# Altium schematic sheet Interface.SchDoc
size B; DocumentNumber: 3; SheetNumber: 3; SheetTotal: 7; ENG_APP_DATE: --/--/--; DSN_APP_DATE: --/--/--; CHK_APP_DATE: --/--/--
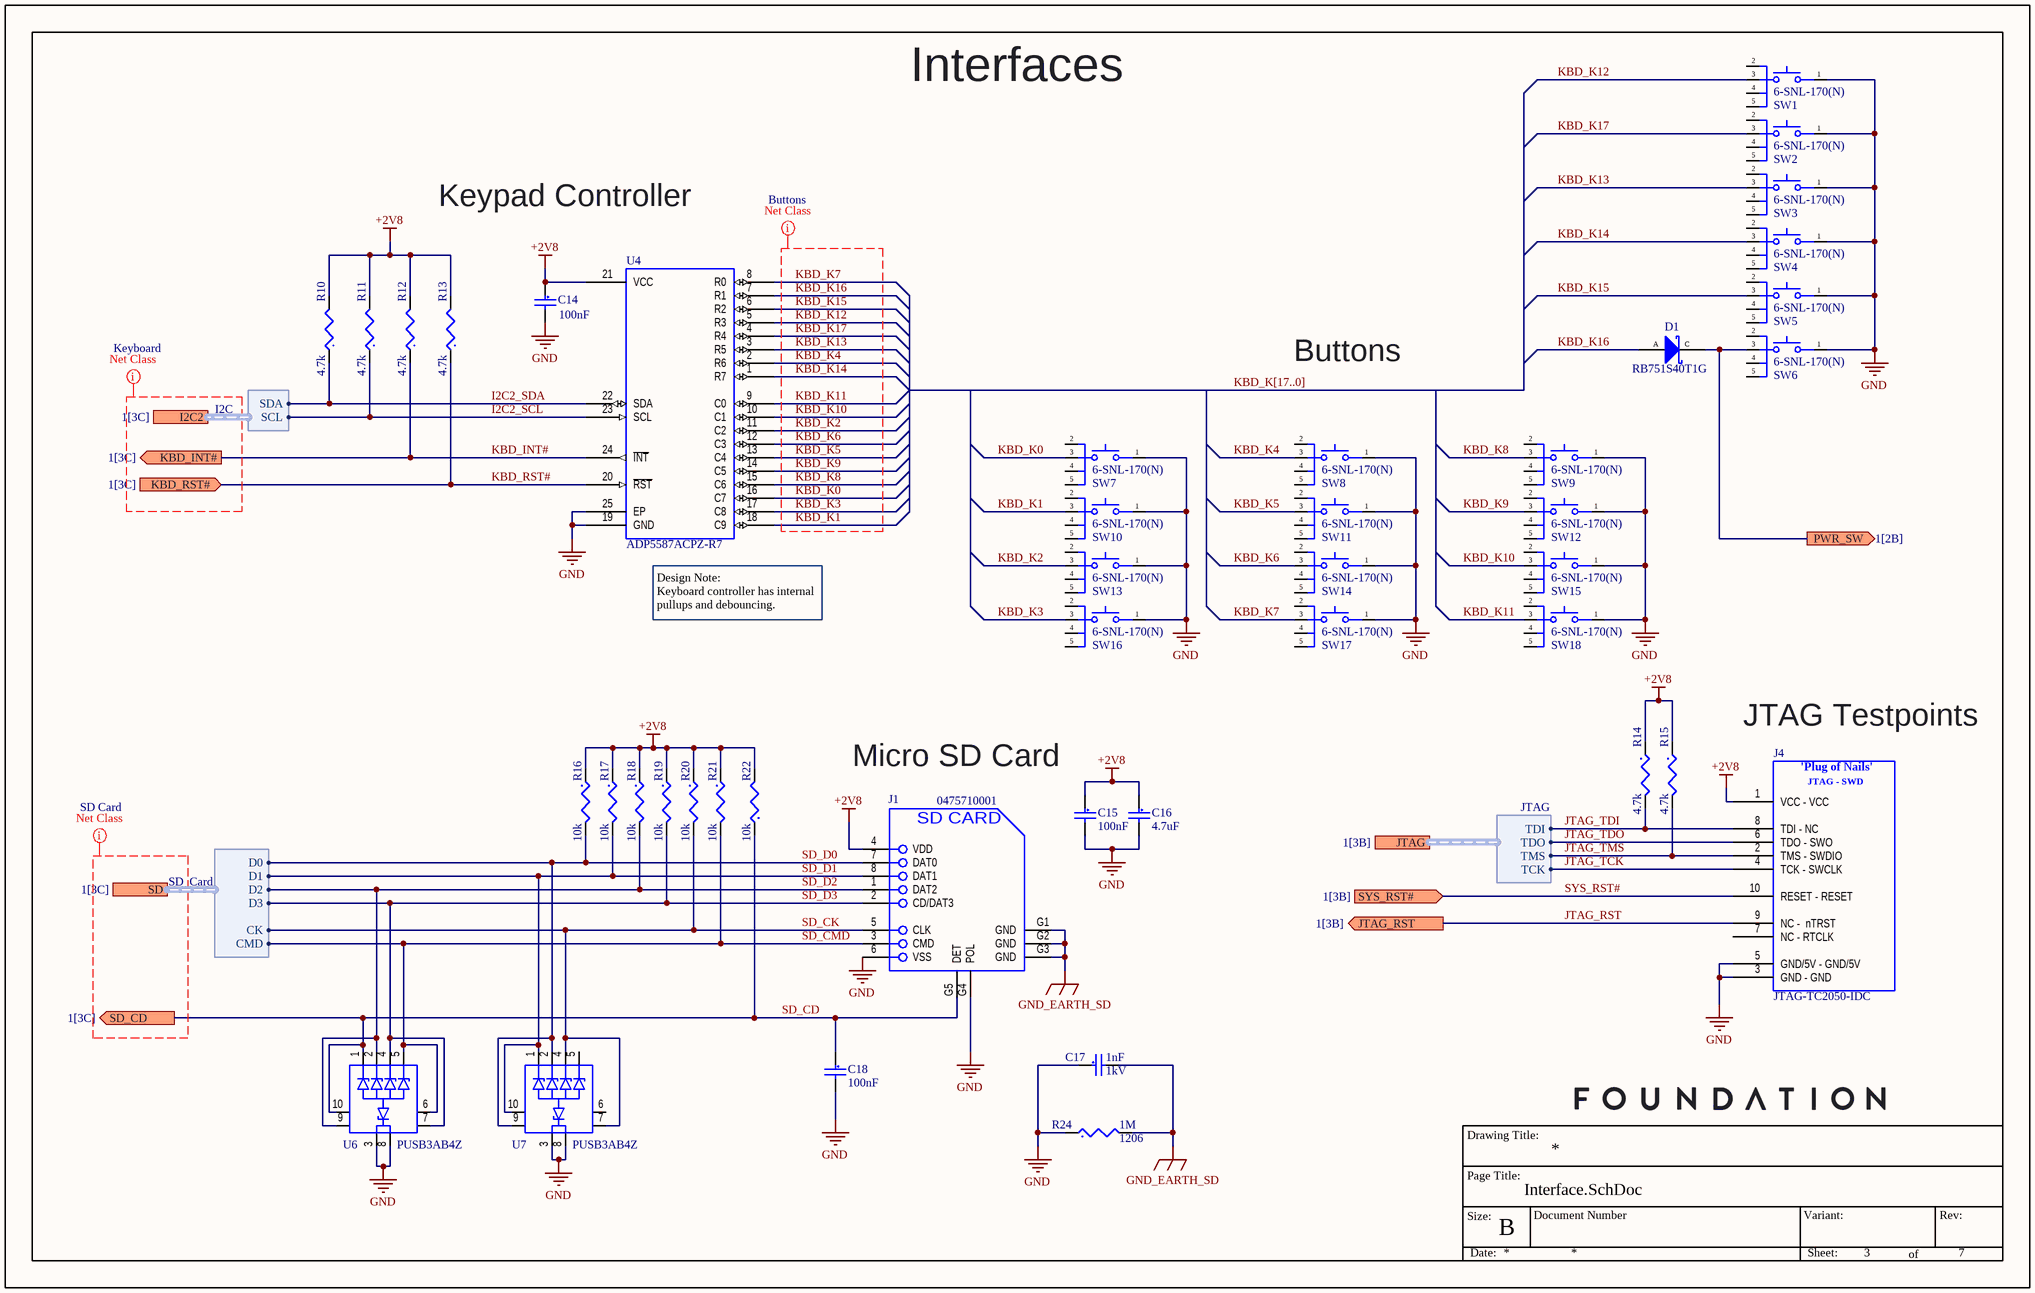
[diagram p0: Interface.SchDoc]

## Parts
C14  Capacitance: 100nF  [CAPC0402(1005)55_L]  (hidden comment: CAP CER 0.1uF 16V 10% X7R 0402)
C15  Capacitance: 100nF  [CAPC0402(1005)55_L]  (hidden comment: CAP CER 0.1uF 16V 10% X7R 0402)
C16  Capacitance: 4.7uF  [CAPC0603(1608)90_L]  (hidden comment: CAP CER 4.7uF 16V 10% X5R 0603)
C17  Capacitance: 1nF  Voltage Rating (DC): 1kV  [CAPC0805(2012)145_N]  (hidden comment: CAP CER 1000pF 1000V 10% X7R 0805)
C18  Capacitance: 100nF  [CAPC0402(1005)55_L]  (hidden comment: CAP CER 0.1uF 16V 10% X7R 0402)
D1  RB751S40T1G  [ON - SOD-523_V]
J1  0475710001  [MOLX - 0475710001_V]
J4  JTAG-TC2050-IDC  [TAGC - TC2050-IDC-FP_V]  (no BOM)
R10  Resistance: 4.7k  [RESC0402(1005)_L]  (hidden comment: RES 4.7K 1/16W 1% 0402)
R11  Resistance: 4.7k  [RESC0402(1005)_L]  (hidden comment: RES 4.7K 1/16W 1% 0402)
R12  Resistance: 4.7k  [RESC0402(1005)_L]  (hidden comment: RES 4.7K 1/16W 1% 0402)
R13  Resistance: 4.7k  [RESC0402(1005)_L]  (hidden comment: RES 4.7K 1/16W 1% 0402)
R14  Resistance: 4.7k  [RESC0402(1005)_L]  (hidden comment: RES 4.7K 1/16W 1% 0402)
R15  Resistance: 4.7k  [RESC0402(1005)_L]  (hidden comment: RES 4.7K 1/16W 1% 0402)
R16  Resistance: 10k  [RESC0402(1005)_L]  (hidden comment: RES 10K 1/16W 1% 0402)
R17  Resistance: 10k  [RESC0402(1005)_L]  (hidden comment: RES 10K 1/16W 1% 0402)
R18  Resistance: 10k  [RESC0402(1005)_L]  (hidden comment: RES 10K 1/16W 1% 0402)
R19  Resistance: 10k  [RESC0402(1005)_L]  (hidden comment: RES 10K 1/16W 1% 0402)
R20  Resistance: 10k  [RESC0402(1005)_L]  (hidden comment: RES 10K 1/16W 1% 0402)
R21  Resistance: 10k  [RESC0402(1005)_L]  (hidden comment: RES 10K 1/16W 1% 0402)
R22  Resistance: 10k  [RESC0402(1005)_L]  (hidden comment: RES 10K 1/16W 1% 0402)
R24  Resistance: 1M  Case Code (Imperial): 1206  [RESC1206(3216)_L]  (hidden comment: RES 1.0M 1/4W 5% 1206)
SW1  6-SNL-170(N)  [TACT - 6-SNL-170_NTP_V]
SW2  6-SNL-170(N)  [TACT - 6-SNL-170_NTP_V]
SW3  6-SNL-170(N)  [TACT - 6-SNL-170_NTP_V]
SW4  6-SNL-170(N)  [TACT - 6-SNL-170_NTP_V]
SW5  6-SNL-170(N)  [TACT - 6-SNL-170_NTP_V]
SW6  6-SNL-170(N)  [TACT - 6-SNL-170_NTP_V]
SW7  6-SNL-170(N)  [TACT - 6-SNL-170_NTP_V]
SW8  6-SNL-170(N)  [TACT - 6-SNL-170_NTP_V]
SW9  6-SNL-170(N)  [TACT - 6-SNL-170_NTP_V]
SW10  6-SNL-170(N)  [TACT - 6-SNL-170_NTP_V]
SW11  6-SNL-170(N)  [TACT - 6-SNL-170_NTP_V]
SW12  6-SNL-170(N)  [TACT - 6-SNL-170_NTP_V]
SW13  6-SNL-170(N)  [TACT - 6-SNL-170_NTP_V]
SW14  6-SNL-170(N)  [TACT - 6-SNL-170_NTP_V]
SW15  6-SNL-170(N)  [TACT - 6-SNL-170_NTP_V]
SW16  6-SNL-170(N)  [TACT - 6-SNL-170_NTP_V]
SW17  6-SNL-170(N)  [TACT - 6-SNL-170_NTP_V]
SW18  6-SNL-170(N)  [TACT - 6-SNL-170_NTP_V]
U4  ADP5587ACPZ-R7  [ADEV - LFCSP-24_L]
U6  PUSB3AB4Z  [NEXP - DFN2510A-10_L]
U7  PUSB3AB4Z  [NEXP - DFN2510A-10_L]

## Ports
I2C2 (harness I2C, see 1[3C]), JTAG (harness JTAG, see 1[3B]), JTAG_RST (out, see 1[3B]), KBD_INT# (out, see 1[3C]), KBD_RST# (in, see 1[3C]), PWR_SW (out, see 1[2B]), SD (harness SD_Card, see 1[3C]), SD_CD (out, see 1[3C]), SYS_RST# (in, see 1[3B])

## Harnesses
SD_Card: CK, CMD, D0, D1, D2, D3
I2C: SCL, SDA
JTAG: TCK, TDI, TDO, TMS

## Nets
+2V8: C14.1 C15.1 C16.1 J1.4(VDD) J4.1(VCC_-_VCC) R10.2 R11.2 R12.2 R13.2 R14.1 R15.1 R16.1 R17.1 R18.1 R19.1 R20.1 R21.1 R22.2 U4.21(VCC)
GND: C14.2 C15.2 C16.2 C17.1 C18.2 J1.6(VSS) J1.G4(POL) J4.3(GND_-_GND) J4.5(GND/5V_-_GND/5V) R24.1 SW1.1 SW2.1 SW3.1 SW4.1 SW5.1 SW6.1 SW7.1 SW8.1 SW9.1 SW10.1 SW11.1 SW12.1 SW13.1 SW14.1 SW15.1 SW16.1 SW17.1 SW18.1 U4.19(GND) U4.25(EP) U6.3(DIODE) U6.8(DIODE) U7.3(DIODE) U7.8(DIODE)
GND_EARTH_SD: C17.2 J1.G1(GND) J1.G2(GND) J1.G3(GND) R24.2
I2C2_SCL: R11.1 U4.23(SCL) ; port I2C2.SCL
I2C2_SDA: R10.1 U4.22(SDA) ; port I2C2.SDA
JTAG_RST: J4.9(NC_-__nTRST) ; port JTAG_RST
JTAG_TCK: J4.4(TCK_-_SWCLK) ; port JTAG.TCK
JTAG_TDI: J4.8(TDI_-_NC) R14.2 ; port JTAG.TDI
JTAG_TDO: J4.6(TDO_-_SWO) ; port JTAG.TDO
JTAG_TMS: J4.2(TMS_-_SWDIO) R15.2 ; port JTAG.TMS
KBD_INT#: R12.1 U4.24(~{INT}) ; port KBD_INT#
KBD_K0: SW7.3 U4.16(C7)
KBD_K1: SW10.3 U4.18(C9)
KBD_K2: SW13.3 U4.11(C2)
KBD_K3: SW16.3 U4.17(C8)
KBD_K4: SW8.3 U4.2(R6)
KBD_K5: SW11.3 U4.13(C4)
KBD_K6: SW14.3 U4.12(C3)
KBD_K7: SW17.3 U4.8(R0)
KBD_K8: SW9.3 U4.15(C6)
KBD_K9: SW12.3 U4.14(C5)
KBD_K10: SW15.3 U4.10(C1)
KBD_K11: SW18.3 U4.9(C0)
KBD_K12: SW1.3 U4.5(R3)
KBD_K13: SW3.3 U4.3(R5)
KBD_K14: SW4.3 U4.1(R7)
KBD_K15: SW5.3 U4.6(R2)
KBD_K16: D1.A U4.7(R1)
KBD_K17: SW2.3 U4.4(R4)
KBD_RST#: R13.1 U4.20(~{RST}) ; port KBD_RST#
PWR_SW: D1.C SW6.3 ; port PWR_SW
SD_CD: C18.1 J1.G5(DET) R22.1 U6.1(DIODE) U6.10(DIODE) ; port SD_CD
SD_CK: J1.5(CLK) R20.2 U7.4(DIODE) U7.7(DIODE) ; port SD.CK
SD_CMD: J1.3(CMD) R21.2 U6.5(DIODE) U6.6(DIODE) ; port SD.CMD
SD_D0: J1.7(DAT0) R16.2 U7.2(A) U7.9(DIODE) ; port SD.D0
SD_D1: J1.8(DAT1) R17.2 U7.1(DIODE) U7.10(DIODE) ; port SD.D1
SD_D2: J1.1(DAT2) R18.2 U6.2(A) U6.9(DIODE) ; port SD.D2
SD_D3: J1.2(CD/DAT3) R19.2 U6.4(DIODE) U6.7(DIODE) ; port SD.D3
SYS_RST#: J4.10(RESET_-_RESET) ; port SYS_RST#

Not connected (* = marked no-connect by the designer): J4 7(NC_-_RTCLK); SW1 2 4 5; SW2 2 4 5; SW3 2 4 5; SW4 2 4 5; SW5 2 4 5; SW6 2 4 5; SW7 2 4 5; SW8 2 4 5; SW9 2 4 5; SW10 2 4 5; SW11 2 4 5; SW12 2 4 5; SW13 2 4 5; SW14 2 4 5; SW15 2 4 5; SW16 2 4 5; SW17 2 4 5; SW18 2 4 5; U7 5(DIODE) 6(DIODE)

## Buses and harness runs
bus KBD_K[17..0]

## Layout directives
net class Keyboard: (no net found under the mark)
net class SD Card: (no net found under the mark)
net class Buttons: KBD_K0, KBD_K1, KBD_K2, KBD_K3, KBD_K4, KBD_K5, KBD_K6, KBD_K7, KBD_K8, KBD_K9, KBD_K10, KBD_K11, KBD_K12, KBD_K13, KBD_K14, KBD_K15, KBD_K16, KBD_K17

## Notes on the sheet
- Interfaces
- Keypad Controller
- Buttons
- (near U4) Design Note:
  Keyboard controller has internal pullups and debouncing.
- (near C15) Micro SD Card
- JTAG Testpoints
- Drawing Title:
- Page Title:
- Size:
- B
- Document Number
- Variant:
- Rev:
- Date:
- Sheet:
- of
- (in symbol CMP-CON-0006-11) 'Plug of Nails'; JTAG - SWD
- (in symbol CMP-CON-0008-2) SD CARD

## Library data of the parts
C14 C15 C18 = CMP-CAP-00002-2: 0.1µF ±10% 16V Ceramic Capacitor X7R 0402 (1005 Metric); Insulation Resistance: 10GR; Material: Ceramic; Tolerance: 10%; REACH SVHC: No SVHC; Radiation Hardening: No; Case Code (Metric): 1005; Height: 0.5mm; Depth: 0.5mm; Min Operating Temperature: -55°C; Max Operating Temperature: 125°C; Lead Free: Lead Free; Thickness: 0.022inch; Length: 1mm; Voltage Rating (DC): 16V; Dielectric Material: Ceramic; Packaging: Tape and Reel; Case/Package: 0402; Width: 0.5mm; Termination: SMD/SMT; Voltage Rating: 16V; Mount: Surface Mount; Case Code (Imperial): 0402; Package Quantity: 1; Dielectric: X7R; Number of Pins: 2; Voltage: 16V
C16 = CMP-CAP-00003-1: 4.7µF ±10% 16V Ceramic Capacitor X5R 0603 (1608 Metric); Length: 1.6mm; Termination: SMD/SMT; Max Operating Temperature: 85°C; Case Code (Imperial): 0603; Height: 0.8mm; Voltage Rating: 16V; Composition: Ceramic; Dielectric: X5R; Voltage Rating (DC): 16V; REACH SVHC: No SVHC; Case Code (Metric): 1608; Tolerance: 10%; Case/Package: 0603; Min Operating Temperature: -55°C; Width: 0.8mm; Mount: Surface Mount; Packaging: Tape and Reel; Package Quantity: 1; Thickness: 0.035inch; Number of Pins: 2
C17 = CMP-CAP-00004-1: 1000pF ±10% 1000V (1kV) Ceramic Capacitor X7R 0805 (2012 Metric); Insulation Resistance: 100GR; Mount: Surface Mount; Width: 1.25mm; Voltage Rating: 1kV; Number of Pins: 2; Packaging: Tape and Reel; Package Quantity: 4000; Termination: SMD/SMT; Height: 1.3mm; Case Code (Metric): 2012; Depth: 1.25mm; Dielectric: X7R; Thickness: 0.051inch; Length: 2.01mm; Case Code (Imperial): 0805; Contact Plating: Nickel,Tin,Matte; Dissipation Factor: 10%; Tolerance: 10%; Case/Package: 0805; Min Operating Temperature: -55°C; REACH SVHC: No SVHC; Lead Free: Lead Free; Dielectric Material: Ceramic; Max Operating Temperature: 125°C
D1 = CMP-DIO-0007-1: Diode Schottky 30V 30mA (DC) Surface Mount SOD-523; Voltage Rating (DC): 40V; Peak Non-Repetitive Surge Current: 500mA; Peak Reverse Current: 500nA; Element Configuration: Single; Capacitance: 2.5pF; Power Dissipation: 200mW; Polarity: Standard; Forward Voltage: 370mV; Radiation Hardening: No; Min Operating Temperature: -55°C; Current Rating: 30mA; Forward Current: 30mA; Number of Pins: 2; Average Rectified Current: 30mA; Output Current: 30mA; Max Operating Temperature: 150°C; Width: 0.9mm; ComponentLink1Description: Datasheet; Length: 1.3mm; Max Surge Current: 500mA; Max Reverse Voltage (DC): 30V; REACH SVHC: No SVHC; Lead Free: Lead Free; Max Reverse Leakage Current: 500nA; Max Forward Surge Current (Ifsm): 500mA; Package Quantity: 1; ComponentLink1URL: https://www.onsemi.cn/PowerSolutions/document/RB751S40T1-D.PDF; Max Repetitive Reverse Voltage (Vrrm): 40V; Contact Plating: Tin,Matte; Case/Package: SOD-523-2; Height: 0.7mm; Packaging: Tape and Reel
J1 = CMP-CON-0008-2: CONN MICRO SD CARD PUSH-PULL R/A; Connector Type: Connector; Number of Contacts: 8; Pitch: 1.1mm; ComponentLink1Description: Drawing; Packaging: Tape and Reel; ComponentLink3Description: Spec; Depth: 5.45mm; Max Operating Temperature: 85°C; Termination: Solder; Housing Material: Polymer; ComponentLink2Description: Electrical Model; Contact Material: Bronze; ComponentLink1URL: https://www.molex.com/pdm_docs/sd/475710001_sd.pdf; Orientation: Right Angle; Min Operating Temperature: -40°C; Mount: Surface Mount; ComponentLink3URL: https://www.molex.com/pdm_docs/ps/PS-47309-001.pdf; ComponentLink2URL: https://media.digikey.com/pdf/Data%20Sheets/Molex%20PDFs/0475710001_Elect_Model.pdf; Contact Plating: Gold; Package Quantity: 1500; Length: 11.4mm; Number of Rows: 1
J4 = CMP-CON-0006-11: PLUG-OF-NAILS 10-PIN W/LEGS; ComponentLink3Description: Cable; ComponentLink2Description: Adapter; ComponentLink1Description: Datasheet; ComponentLink2URL: https://www.tag-connect.com/wp-content/uploads/bsk-pdf-manager/TC2050-ARM2010_18.pdf; ComponentLink3URL: https://www.digikey.com/product-detail/en/tag-connect-llc/TC2050-IDC/TC2050-IDC-ND/2605366; Case/Package: Custom; ComponentLink1URL: https://www.tag-connect.com/wp-content/uploads/bsk-pdf-manager/TC2050-IDC_Datasheet_7.pdf
R10-R15 = CMP-RES-00002-3: 4.7 kOhms ±1% 0.063W, 1/16W Chip Resistor 0402 (1005 Metric) Automotive AEC-Q200 Thick Film; Max Power Dissipation: 63mW; Voltage Rating (DC): 50V; Temperature Coefficient: 100ppm/°C; Weight: 2.3E-05oz; Package Quantity: 10; Military Standard: Not; Contact Plating: Tin; Termination: SMD/SMT; Max Operating Temperature: 155°C; Case Code (Metric): 1005; Case Code (Imperial): 0402; Features: Automotive AEC-Q200; Power Rating: 63mW; REACH SVHC: Unknown; Min Operating Temperature: -55°C; Tolerance: 1%; Mount: Surface Mount; Width: 0.5mm; Depth: 0.5mm; Radiation Hardening: No; Length: 1mm; Number of Terminations: 2; Case/Package: 0402; Voltage Rating: 50V; Height: 0.35mm; Packaging: Tape and Reel; Lead Free: Lead Free; Composition: Thick Film
R16-R21 = CMP-RES-00006-3: 10 kOhms ±1% 0.063W, 1/16W Chip Resistor 0402 (1005 Metric); Voltage Rating (DC): 50V; Power Rating: 63mW; Temperature Coefficient: 100ppm/°C; Case Code (Imperial): 0402; Mount: Surface Mount; Composition: Thick Film; Features: Automotive AEC-Q200; Depth: 0.5mm; Height: 0.35mm; Weight: 2.3E-05oz; Number of Pins: 2; Termination: SMD/SMT; Min Operating Temperature: -55°C; Length: 1mm; Package Quantity: 10; Lead Free: Lead Free; Radiation Hardening: No; Max Operating Temperature: 155°C; Voltage Rating: 50V; Military Standard: Not; Case/Package: 0402; Contact Plating: Tin; Max Power Dissipation: 63mW; Tolerance: 1%; Case Code (Metric): 1005; Number of Terminations: 2; Packaging: Tape and Reel; REACH SVHC: Unknown; Width: 0.02inch
R22 = CMP-RES-00006-3: 10 kOhms ±1% 0.063W, 1/16W Chip Resistor 0402 (1005 Metric); Max Power Dissipation: 63mW; Voltage Rating (DC): 50V; Temperature Coefficient: 100ppm/°C; Width: 0.02inch; Power Rating: 63mW; Case/Package: 0402; Min Operating Temperature: -55°C; Number of Terminations: 2; Lead Free: Lead Free; Features: Automotive AEC-Q200; Number of Pins: 2; Tolerance: 1%; Height: 0.35mm; Mount: Surface Mount; Radiation Hardening: No; Length: 1mm; Case Code (Metric): 1005; Weight: 2.3E-05oz; Military Standard: Not; Depth: 0.5mm; Package Quantity: 10; Max Operating Temperature: 155°C; Termination: SMD/SMT; Case Code (Imperial): 0402; Contact Plating: Tin; Voltage Rating: 50V; Composition: Thick Film; Packaging: Tape and Reel; REACH SVHC: Unknown
R24 = CMP-RES-00004-3: 1 MOhms ±5% 0.25W, 1/4W Chip Resistor 1206 (3216 Metric) Moisture Resistant Thick Film; Power Rating: 250mW; Temperature Coefficient: 200ppm/°C; Voltage Rating: 200V; Mount: Surface Mount; Radiation Hardening: No; Tolerance: 5%; Military Standard: Not; Termination: SMD/SMT; Case Code (Metric): 3216; Depth: 1.6mm; Case/Package: 1206; REACH SVHC: No SVHC; Height: 0.6mm; Max Operating Temperature: 155°C; Package Quantity: 5000; Thickness: 610um; Min Operating Temperature: -55°C; Voltage Rating (DC): 200V; Length: 3.2mm; Composition: Thick Film; Width: 1.6mm; Packaging: Tape and Reel; Contact Plating: Tin
SW1-SW18 = CMP-SWH-00000-9: Tactile Components. 6mm star dome tactile switch.
U4 = CMP-IC-INT-0000-10: I/O Expander 18 I²C 400kHz 24-LFCSP-WQ (4x4); Max Supply Voltage: 3.6V; Number of I/Os: 18; Nominal Supply Current: 200uA; Min Supply Voltage: 1.65V; Interface: I2C; Number of Pins: 24; REACH SVHC: No SVHC; Case/Package: 24-LFCSP-WQ (4x4); Max Operating Temperature: 85°C; Package Quantity: 1500; Min Operating Temperature: -40°C; Frequency: 400kHz; Packaging: Tape and Reel; Mount: Surface Mount; Lead Free: Contains Lead; Max Frequency: 400kHz; ComponentLink1URL: https://www.analog.com/media/en/technical-documentation/data-sheets/ADP5587.pdf; ComponentLink1Description: Datasheet; Max Supply Current: 200uA
U6 U7 = CMP-DIO-0006-4: TVS DIODE 3.3V 5V DFN2510A-10; Capacitance @ Frequency: 0.17pF @ 1MHz; Bidirectional Channels: 4; Type: Zener; Max Operating Temperature: 85°C; Min Operating Temperature: -40°C; Case/Package: DFN2510A-10; ComponentLink1Description: Datasheet; ComponentLink1URL: https://assets.nexperia.com/documents/data-sheet/PUSB3AB4.pdf